# Altium project PiMX8MP_r0.3_release.PrjPcb
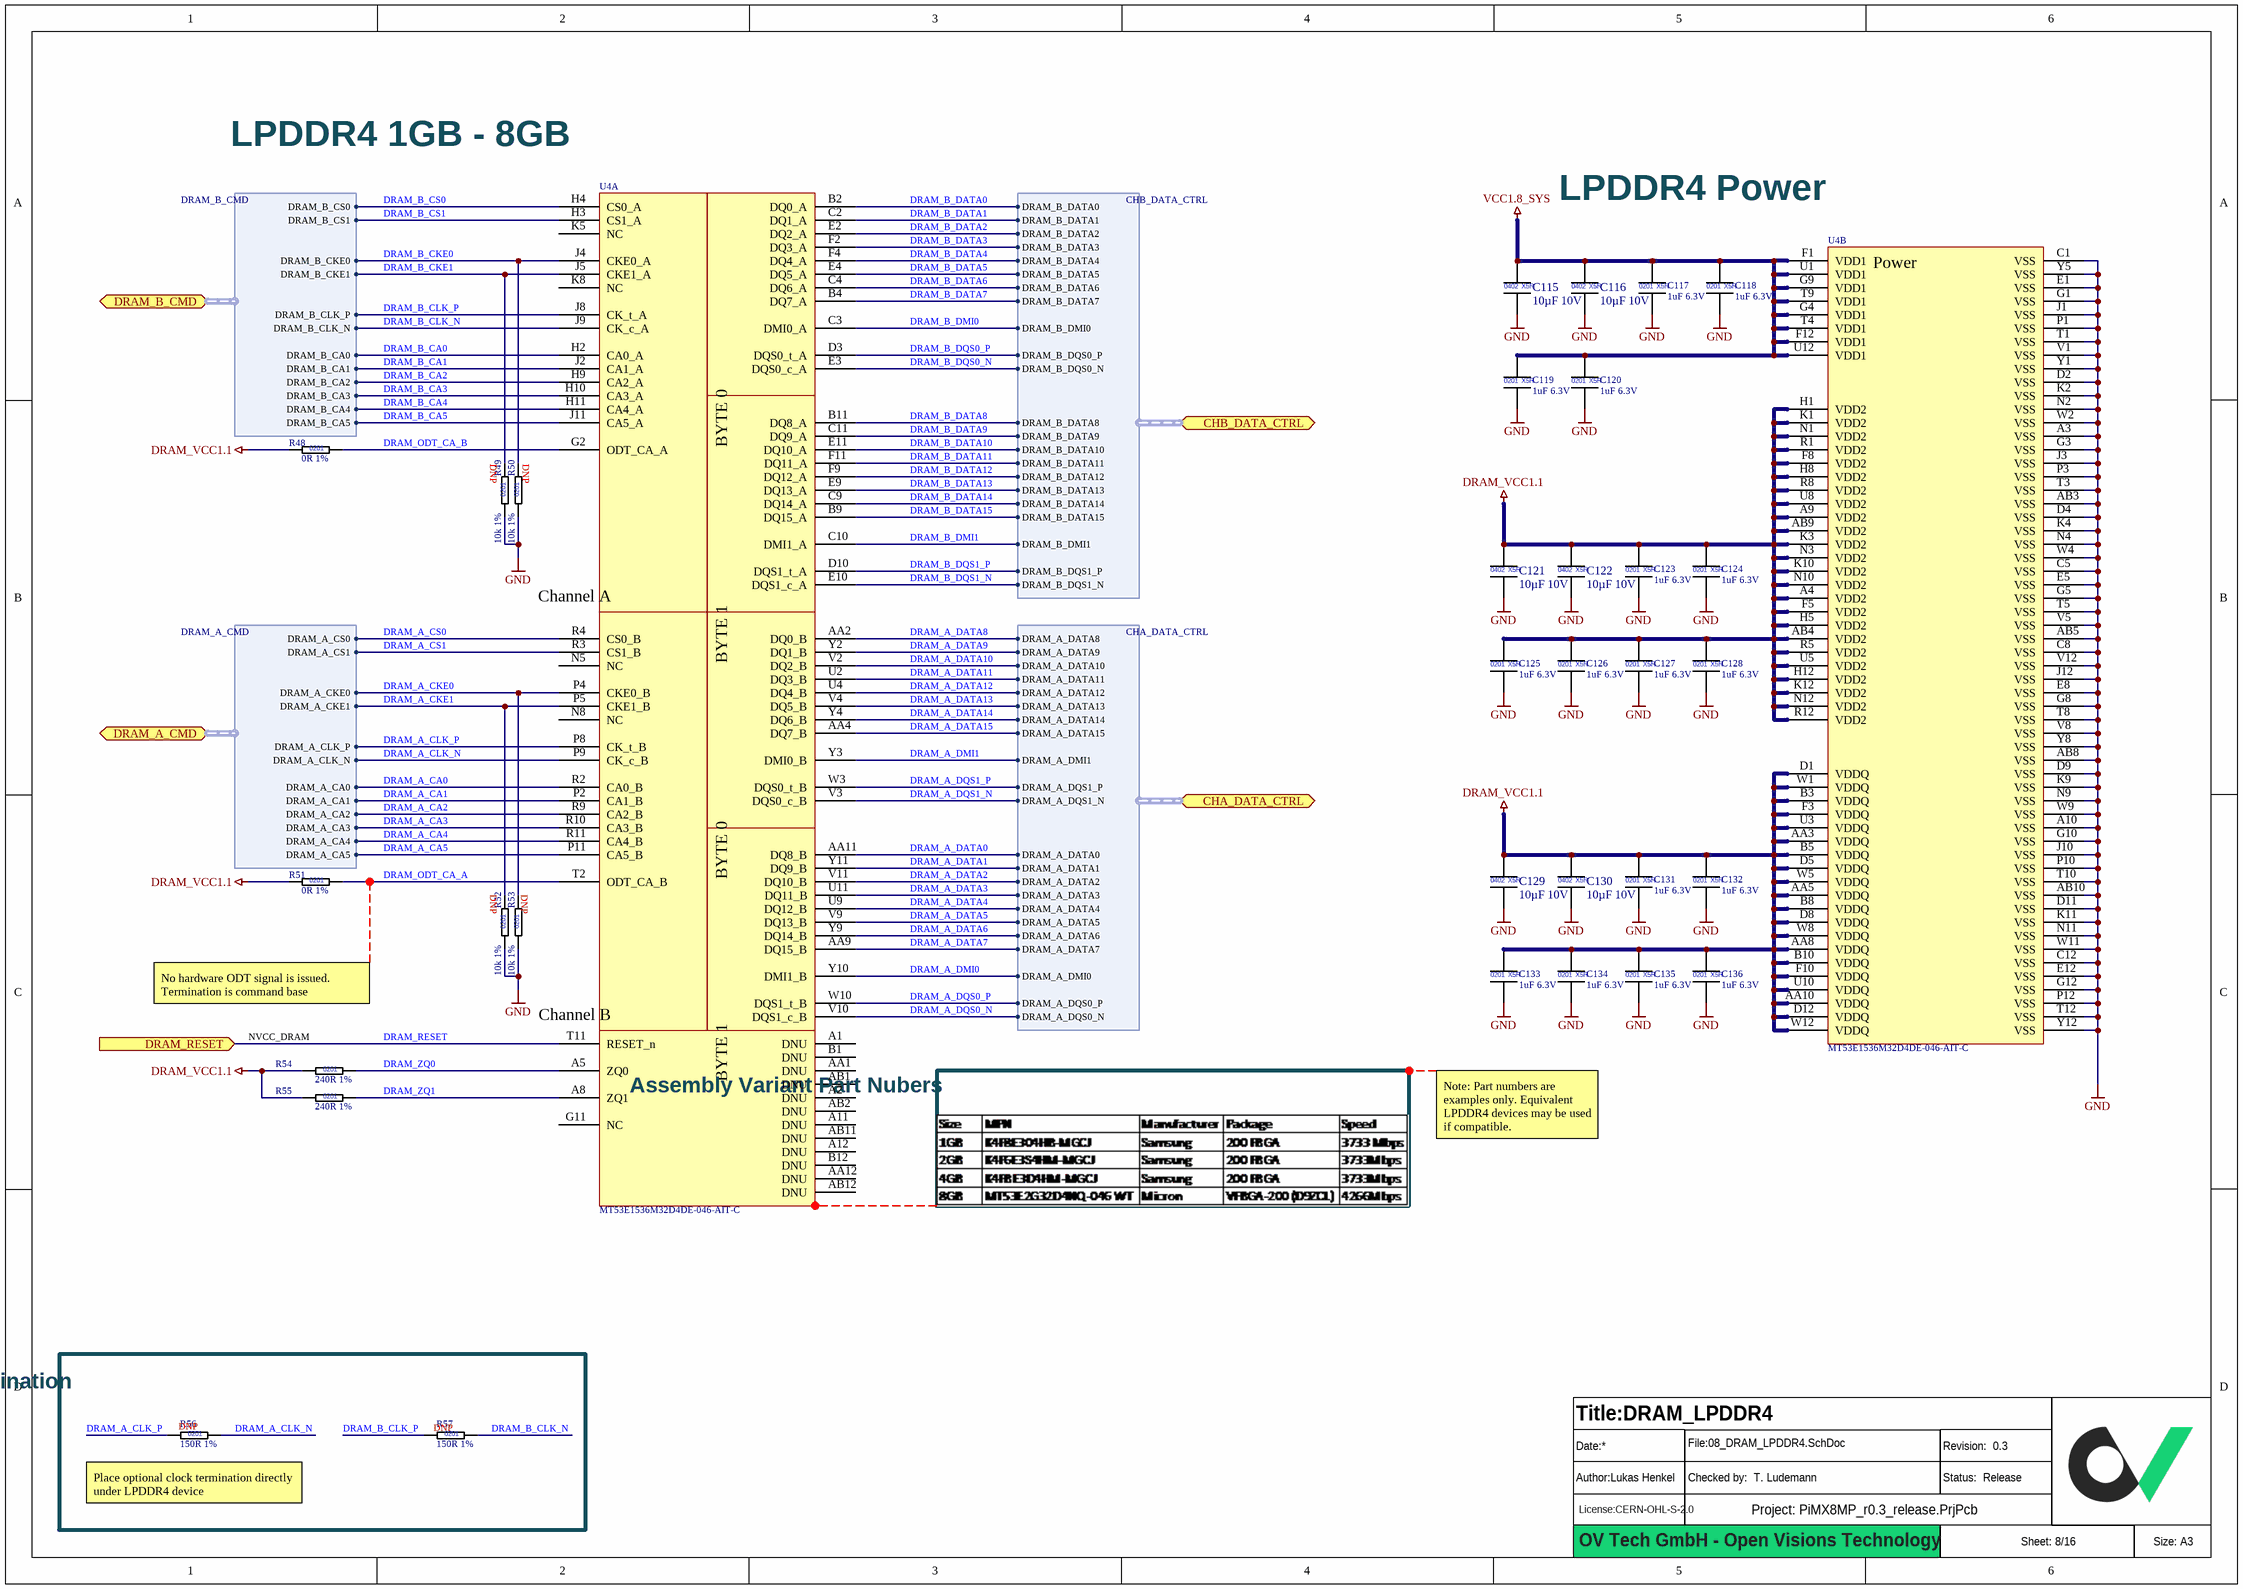
[diagram p0: 08_DRAM_LPDDR4.SchDoc]
Customer: OV Tech GmbH; DevStatus: Release; License: CERN-OHL-S-2.0; Reviewer: T. Ludemann; Revision: 0.3
2 sheets, 76 parts. Net scope: flat (ports and power ports of the same name join across sheets).
Board files: PiMX8MP_r0.3.PcbDoc, PiMX8MP_r0.3_Panel.PcbDoc
Sheets:
  08_DRAM_LPDDR4.SchDoc
  09_eMMC_Flash.SchDoc

## Sheet 08_DRAM_LPDDR4.SchDoc: DRAM_LPDDR4
size 420 x 297 mm; Author: Lukas Henkel; DocumentNumber: 8; SheetNumber: 8; SheetTotal: 16; DocSize: A3

### Parts
(Parts that share a designator on the sheet are numbered #1, #2 ... from top to bottom, then left to right.)
?#1  (no value)  (graphical)
C115  10µF 10V  [CAPC1005X06L]
C116  10µF 10V  [CAPC1005X06L]
C117  1uF 6.3V  [CAPC0603X03L]
C118  1uF 6.3V  [CAPC0603X03L]
C119  1uF 6.3V  [CAPC0603X03L]
C120  1uF 6.3V  [CAPC0603X03L]
C121  10µF 10V  [CAPC1005X06L]
C122  10µF 10V  [CAPC1005X06L]
C123  1uF 6.3V  [CAPC0603X03L]
C124  1uF 6.3V  [CAPC0603X03L]
C125  1uF 6.3V  [CAPC0603X03L]
C126  1uF 6.3V  [CAPC0603X03L]
C127  1uF 6.3V  [CAPC0603X03L]
C128  1uF 6.3V  [CAPC0603X03L]
C129  10µF 10V  [CAPC1005X06L]
C130  10µF 10V  [CAPC1005X06L]
C131  1uF 6.3V  [CAPC0603X03L]
C132  1uF 6.3V  [CAPC0603X03L]
C133  1uF 6.3V  [CAPC0603X03L]
C134  1uF 6.3V  [CAPC0603X03L]
C135  1uF 6.3V  [CAPC0603X03L]
C136  1uF 6.3V  [CAPC0603X03L]
R48  0R 1%  [RESC0603X03L]
R49  10k 1%  [RESC0603X03L]  (no BOM)
R50  10k 1%  [RESC0603X03L]  (no BOM)
R51  0R 1%  [RESC0603X03L]
R52  10k 1%  [RESC0603X03L]  (no BOM)
R53  10k 1%  [RESC0603X03L]  (no BOM)
R54  240R 1%  [RESC0603X03L]
R55  240R 1%  [RESC0603X03L]
R56  150R 1%  [RESC0603X03L]  (no BOM)
R57  150R 1%  [RESC0603X03L]  (no BOM)
U4  MT53E1536M32D4DE-046-AIT-C  [BGA200C65P12X22_1000X1450X114]  (parts A,B of 2)

### Blocks framed on the sheet
Clock Termination: R56 R57

### Ports
CHA_DATA_CTRL (bidir, harness CHA_DATA_CTRL), CHB_DATA_CTRL (bidir, harness CHB_DATA_CTRL), DRAM_A_CMD (bidir, harness DRAM_A_CMD), DRAM_B_CMD (bidir, harness DRAM_B_CMD), DRAM_RESET (in)

### Harnesses
DRAM_A_CMD: DRAM_A_CA0, DRAM_A_CA1, DRAM_A_CA2, DRAM_A_CA3, DRAM_A_CA4, DRAM_A_CA5, DRAM_A_CS0, DRAM_A_CS1, DRAM_A_CKE0, DRAM_A_CKE1, DRAM_A_CLK_P, DRAM_A_CLK_N
DRAM_B_CMD: DRAM_B_CA0, DRAM_B_CA1, DRAM_B_CA2, DRAM_B_CA3, DRAM_B_CA4, DRAM_B_CA5, DRAM_B_CS0, DRAM_B_CS1, DRAM_B_CKE0, DRAM_B_CKE1, DRAM_B_CLK_P, DRAM_B_CLK_N
CHA_DATA_CTRL: DRAM_A_DATA0, DRAM_A_DATA1, DRAM_A_DATA2, DRAM_A_DATA3, DRAM_A_DATA4, DRAM_A_DATA5, DRAM_A_DATA6, DRAM_A_DATA7, DRAM_A_DATA8, DRAM_A_DATA9, DRAM_A_DATA10, DRAM_A_DATA11, DRAM_A_DATA12, DRAM_A_DATA13, DRAM_A_DATA14, DRAM_A_DATA15, DRAM_A_DMI0, DRAM_A_DMI1, DRAM_A_DQS0_P, DRAM_A_DQS0_N, DRAM_A_DQS1_P, DRAM_A_DQS1_N
CHB_DATA_CTRL: DRAM_B_DATA0, DRAM_B_DATA1, DRAM_B_DATA2, DRAM_B_DATA3, DRAM_B_DATA4, DRAM_B_DATA5, DRAM_B_DATA6, DRAM_B_DATA7, DRAM_B_DATA8, DRAM_B_DATA9, DRAM_B_DATA10, DRAM_B_DATA11, DRAM_B_DATA12, DRAM_B_DATA13, DRAM_B_DATA14, DRAM_B_DATA15, DRAM_B_DMI0, DRAM_B_DMI1, DRAM_B_DQS0_P, DRAM_B_DQS0_N, DRAM_B_DQS1_P, DRAM_B_DQS1_N

### Nets
DRAM_VCC1.1: C121.1 C122.1 C123.1 C124.1 C125.1 C126.1 C127.1 C128.1 C129.1 C130.1 C131.1 C132.1 C133.1 C134.1 C135.1 C136.1 R48.1 R51.1 R54.1 R55.1 U4.A4(VDD2) U4.A9(VDD2) U4.AA3(VDDQ) U4.AA5(VDDQ) U4.AA8(VDDQ) U4.AA10(VDDQ) U4.AB4(VDD2) U4.AB9(VDD2) U4.B3(VDDQ) U4.B5(VDDQ) U4.B8(VDDQ) U4.B10(VDDQ) U4.D1(VDDQ) U4.D5(VDDQ) U4.D8(VDDQ) U4.D12(VDDQ) U4.F3(VDDQ) U4.F5(VDD2) U4.F8(VDD2) U4.F10(VDDQ) U4.H1(VDD2) U4.H5(VDD2) U4.H8(VDD2) U4.H12(VDD2) U4.K1(VDD2) U4.K3(VDD2) U4.K10(VDD2) U4.K12(VDD2) U4.N1(VDD2) U4.N3(VDD2) U4.N10(VDD2) U4.N12(VDD2) U4.R1(VDD2) U4.R5(VDD2) U4.R8(VDD2) U4.R12(VDD2) U4.U3(VDDQ) U4.U5(VDD2) U4.U8(VDD2) U4.U10(VDDQ) U4.W1(VDDQ) U4.W5(VDDQ) U4.W8(VDDQ) U4.W12(VDDQ)
GND: C115.2 C116.2 C117.2 C118.2 C119.2 C120.2 C121.2 C122.2 C123.2 C124.2 C125.2 C126.2 C127.2 C128.2 C129.2 C130.2 C131.2 C132.2 C133.2 C134.2 C135.2 C136.2 R49.1 R50.1 R52.1 R53.1 U4.A3(VSS) U4.A10(VSS) U4.AB3(VSS) U4.AB5(VSS) U4.AB8(VSS) U4.AB10(VSS) U4.C1(VSS) U4.C5(VSS) U4.C8(VSS) U4.C12(VSS) U4.D2(VSS) U4.D4(VSS) U4.D9(VSS) U4.D11(VSS) U4.E1(VSS) U4.E5(VSS) U4.E8(VSS) U4.E12(VSS) U4.G1(VSS) U4.G3(VSS) U4.G5(VSS) U4.G8(VSS) U4.G10(VSS) U4.G12(VSS) U4.J1(VSS) U4.J3(VSS) U4.J10(VSS) U4.J12(VSS) U4.K2(VSS) U4.K4(VSS) U4.K9(VSS) U4.K11(VSS) U4.N2(VSS) U4.N4(VSS) U4.N9(VSS) U4.N11(VSS) U4.P1(VSS) U4.P3(VSS) U4.P10(VSS) U4.P12(VSS) U4.T1(VSS) U4.T3(VSS) U4.T5(VSS) U4.T8(VSS) U4.T10(VSS) U4.T12(VSS) U4.V1(VSS) U4.V5(VSS) U4.V8(VSS) U4.V12(VSS) U4.W2(VSS) U4.W4(VSS) U4.W9(VSS) U4.W11(VSS) U4.Y1(VSS) U4.Y5(VSS) U4.Y8(VSS) U4.Y12(VSS)
VCC1.8_SYS: C115.1 C116.1 C117.1 C118.1 C119.1 C120.1 U4.F1(VDD1) U4.F12(VDD1) U4.G4(VDD1) U4.G9(VDD1) U4.T4(VDD1) U4.T9(VDD1) U4.U1(VDD1) U4.U12(VDD1)
DRAM_A_CA0: U4.R2(CA0_B) ; port DRAM_A_CMD.DRAM_A_CA0
DRAM_A_CA1: U4.P2(CA1_B) ; port DRAM_A_CMD.DRAM_A_CA1
DRAM_A_CA2: U4.R9(CA2_B) ; port DRAM_A_CMD.DRAM_A_CA2
DRAM_A_CA3: U4.R10(CA3_B) ; port DRAM_A_CMD.DRAM_A_CA3
DRAM_A_CA4: U4.R11(CA4_B) ; port DRAM_A_CMD.DRAM_A_CA4
DRAM_A_CA5: U4.P11(CA5_B) ; port DRAM_A_CMD.DRAM_A_CA5
DRAM_A_CKE0: R53.2 U4.P4(CKE0_B) ; port DRAM_A_CMD.DRAM_A_CKE0
DRAM_A_CKE1: R52.2 U4.P5(CKE1_B) ; port DRAM_A_CMD.DRAM_A_CKE1
DRAM_A_CLK_N: R56.2 U4.P9(CK_c_B) ; port DRAM_A_CMD.DRAM_A_CLK_N
DRAM_A_CLK_P: R56.1 U4.P8(CK_t_B) ; port DRAM_A_CMD.DRAM_A_CLK_P
DRAM_A_CS0: U4.R4(CS0_B) ; port DRAM_A_CMD.DRAM_A_CS0
DRAM_A_CS1: U4.R3(CS1_B) ; port DRAM_A_CMD.DRAM_A_CS1
DRAM_A_DATA0: U4.AA11(DQ8_B) ; port CHA_DATA_CTRL.DRAM_A_DATA0
DRAM_A_DATA1: U4.Y11(DQ9_B) ; port CHA_DATA_CTRL.DRAM_A_DATA1
DRAM_A_DATA2: U4.V11(DQ10_B) ; port CHA_DATA_CTRL.DRAM_A_DATA2
DRAM_A_DATA3: U4.U11(DQ11_B) ; port CHA_DATA_CTRL.DRAM_A_DATA3
DRAM_A_DATA4: U4.U9(DQ12_B) ; port CHA_DATA_CTRL.DRAM_A_DATA4
DRAM_A_DATA5: U4.V9(DQ13_B) ; port CHA_DATA_CTRL.DRAM_A_DATA5
DRAM_A_DATA6: U4.Y9(DQ14_B) ; port CHA_DATA_CTRL.DRAM_A_DATA6
DRAM_A_DATA7: U4.AA9(DQ15_B) ; port CHA_DATA_CTRL.DRAM_A_DATA7
DRAM_A_DATA8: U4.AA2(DQ0_B) ; port CHA_DATA_CTRL.DRAM_A_DATA8
DRAM_A_DATA9: U4.Y2(DQ1_B) ; port CHA_DATA_CTRL.DRAM_A_DATA9
DRAM_A_DATA10: U4.V2(DQ2_B) ; port CHA_DATA_CTRL.DRAM_A_DATA10
DRAM_A_DATA11: U4.U2(DQ3_B) ; port CHA_DATA_CTRL.DRAM_A_DATA11
DRAM_A_DATA12: U4.U4(DQ4_B) ; port CHA_DATA_CTRL.DRAM_A_DATA12
DRAM_A_DATA13: U4.V4(DQ5_B) ; port CHA_DATA_CTRL.DRAM_A_DATA13
DRAM_A_DATA14: U4.Y4(DQ6_B) ; port CHA_DATA_CTRL.DRAM_A_DATA14
DRAM_A_DATA15: U4.AA4(DQ7_B) ; port CHA_DATA_CTRL.DRAM_A_DATA15
DRAM_A_DMI0: U4.Y10(DMI1_B) ; port CHA_DATA_CTRL.DRAM_A_DMI0
DRAM_A_DMI1: U4.Y3(DMI0_B) ; port CHA_DATA_CTRL.DRAM_A_DMI1
DRAM_A_DQS0_N: U4.V10(DQS1_c_B) ; port CHA_DATA_CTRL.DRAM_A_DQS0_N
DRAM_A_DQS0_P: U4.W10(DQS1_t_B) ; port CHA_DATA_CTRL.DRAM_A_DQS0_P
DRAM_A_DQS1_N: U4.V3(DQS0_c_B) ; port CHA_DATA_CTRL.DRAM_A_DQS1_N
DRAM_A_DQS1_P: U4.W3(DQS0_t_B) ; port CHA_DATA_CTRL.DRAM_A_DQS1_P
DRAM_B_CA0: U4.H2(CA0_A) ; port DRAM_B_CMD.DRAM_B_CA0
DRAM_B_CA1: U4.J2(CA1_A) ; port DRAM_B_CMD.DRAM_B_CA1
DRAM_B_CA2: U4.H9(CA2_A) ; port DRAM_B_CMD.DRAM_B_CA2
DRAM_B_CA3: U4.H10(CA3_A) ; port DRAM_B_CMD.DRAM_B_CA3
DRAM_B_CA4: U4.H11(CA4_A) ; port DRAM_B_CMD.DRAM_B_CA4
DRAM_B_CA5: U4.J11(CA5_A) ; port DRAM_B_CMD.DRAM_B_CA5
DRAM_B_CKE0: R50.2 U4.J4(CKE0_A) ; port DRAM_B_CMD.DRAM_B_CKE0
DRAM_B_CKE1: R49.2 U4.J5(CKE1_A) ; port DRAM_B_CMD.DRAM_B_CKE1
DRAM_B_CLK_N: R57.2 U4.J9(CK_c_A) ; port DRAM_B_CMD.DRAM_B_CLK_N
DRAM_B_CLK_P: R57.1 U4.J8(CK_t_A) ; port DRAM_B_CMD.DRAM_B_CLK_P
DRAM_B_CS0: U4.H4(CS0_A) ; port DRAM_B_CMD.DRAM_B_CS0
DRAM_B_CS1: U4.H3(CS1_A) ; port DRAM_B_CMD.DRAM_B_CS1
DRAM_B_DATA0: U4.B2(DQ0_A) ; port CHB_DATA_CTRL.DRAM_B_DATA0
DRAM_B_DATA1: U4.C2(DQ1_A) ; port CHB_DATA_CTRL.DRAM_B_DATA1
DRAM_B_DATA2: U4.E2(DQ2_A) ; port CHB_DATA_CTRL.DRAM_B_DATA2
DRAM_B_DATA3: U4.F2(DQ3_A) ; port CHB_DATA_CTRL.DRAM_B_DATA3
DRAM_B_DATA4: U4.F4(DQ4_A) ; port CHB_DATA_CTRL.DRAM_B_DATA4
DRAM_B_DATA5: U4.E4(DQ5_A) ; port CHB_DATA_CTRL.DRAM_B_DATA5
DRAM_B_DATA6: U4.C4(DQ6_A) ; port CHB_DATA_CTRL.DRAM_B_DATA6
DRAM_B_DATA7: U4.B4(DQ7_A) ; port CHB_DATA_CTRL.DRAM_B_DATA7
DRAM_B_DATA8: U4.B11(DQ8_A) ; port CHB_DATA_CTRL.DRAM_B_DATA8
DRAM_B_DATA9: U4.C11(DQ9_A) ; port CHB_DATA_CTRL.DRAM_B_DATA9
DRAM_B_DATA10: U4.E11(DQ10_A) ; port CHB_DATA_CTRL.DRAM_B_DATA10
DRAM_B_DATA11: U4.F11(DQ11_A) ; port CHB_DATA_CTRL.DRAM_B_DATA11
DRAM_B_DATA12: U4.F9(DQ12_A) ; port CHB_DATA_CTRL.DRAM_B_DATA12
DRAM_B_DATA13: U4.E9(DQ13_A) ; port CHB_DATA_CTRL.DRAM_B_DATA13
DRAM_B_DATA14: U4.C9(DQ14_A) ; port CHB_DATA_CTRL.DRAM_B_DATA14
DRAM_B_DATA15: U4.B9(DQ15_A) ; port CHB_DATA_CTRL.DRAM_B_DATA15
DRAM_B_DMI0: U4.C3(DMI0_A) ; port CHB_DATA_CTRL.DRAM_B_DMI0
DRAM_B_DMI1: U4.C10(DMI1_A) ; port CHB_DATA_CTRL.DRAM_B_DMI1
DRAM_B_DQS0_N: U4.E3(DQS0_c_A) ; port CHB_DATA_CTRL.DRAM_B_DQS0_N
DRAM_B_DQS0_P: U4.D3(DQS0_t_A) ; port CHB_DATA_CTRL.DRAM_B_DQS0_P
DRAM_B_DQS1_N: U4.E10(DQS1_c_A) ; port CHB_DATA_CTRL.DRAM_B_DQS1_N
DRAM_B_DQS1_P: U4.D10(DQS1_t_A) ; port CHB_DATA_CTRL.DRAM_B_DQS1_P
DRAM_ODT_CA_A: R51.2 U4.T2(ODT_CA_B)
DRAM_ODT_CA_B: R48.2 U4.G2(ODT_CA_A)
DRAM_RESET: U4.T11(RESET_n) ; port DRAM_RESET
DRAM_ZQ0: R54.2 U4.A5(ZQ0)
DRAM_ZQ1: R55.2 U4.A8(ZQ1)

Not connected (* = marked no-connect by the designer): U4 A1(DNU) A2(DNU) A11(DNU) A12(DNU) AA1(DNU) AA12(DNU) AB1(DNU) AB2(DNU) AB11(DNU) AB12(DNU) B1(DNU) B12(DNU) G11(NC) K5(NC) K8(NC) N5(NC) N8(NC)

### Notes on the sheet
- LPDDR4 1GB - 8GB
- LPDDR4 Power
- (near R49) DNP
- (near R50) DNP
- (near R52) DNP
- (near R53) DNP
- No hardware ODT signal is issued. Termination is command base
- (near R54) NVCC_DRAM
- Assembly Variant Part Nubers
- Note: Part numbers are examples only. Equivalent LPDDR4 devices may be used if compatible.
- (near R56) DNP
- (near R57) DNP
- (near R56) Place optional clock termination directly under LPDDR4 device
- OV Tech GmbH - Open Visions Technology
- (in symbol CAP_0201_1uF_6.3V) 0201; X5R
- (in symbol CAP_0402_10µ_10V) 0402; X5R
- (in symbol LPDDR4_MT53E1536M32D4DE-046-AIT-C, part A) BYTE 0; Channel A; BYTE 1; Channel B
- (in symbol LPDDR4_MT53E1536M32D4DE-046-AIT-C, part B) Power
- (in symbol RES_0201_0R_1%) 0201
- (in symbol RES_0201_10k_1%) 0201
- (in symbol RES_0201_150R_1%) 0201
- (in symbol RES_0201_240R_1%) 0201

### Library data of the parts
?#1 = Titleblock_01_OpenSource
C115 C116 C121 C122 C129 C130 = CAP_0402_10µ_10V: Multilayer Ceramic Capacitors MLCC - SMD/SMT 0402 10VDC; Manufacturer 1: Murata Electronics; Manufacturer 1 Prt. Nr.: GRM155R61A106ME11D; Manufacturer 2 Prt. Nr.: 0402ZD106MAT4A; Manufacturer 2: KYOCERA AVX
C117-C120 C123-C128 C131-C136 = CAP_0201_1uF_6.3V: Multilayer Ceramic Capacitors MLCC - SMD/SMT 0201 6.3VDC; Manufacturer 1: Murata Electronics; Manufacturer 1 Prt. Nr.: GRM033R60J105MEA2D; Manufacturer 2 Prt. Nr.: CL03A105MQ3CSNC; Manufacturer 2: Samsung Electro-Mechanics
R48 R51 = RES_0201_0R_1%: Thick Film Resistors - SMD 0R OHM 1%; Manufacturer 1: Yageo; Manufacturer 1 Prt. Nr.: RC0201FR-070RL; Manufacturer 2 Prt. Nr.: CRCW02010000Z0ED; Manufacturer 2: Vishay / Dale
R49 R50 R52 R53 = RES_0201_10k_1%: Thick Film Resistors - SMD 10K OHM 1%; Manufacturer 1: Yageo; Manufacturer 1 Prt. Nr.: RC0201FR-0710KL; Manufacturer 2 Prt. Nr.: CRCW020110K0FNED; Manufacturer 2: Vishay / Dale
R54 R55 = RES_0201_240R_1%: Thick Film Resistors - SMD 240 OHM 1%; Manufacturer 1: Yageo; Manufacturer 1 Prt. Nr.: RC0201FR-07240RL; Manufacturer 2 Prt. Nr.: CRCW0201240RFNED; Manufacturer 2: Vishay / Dale
R56 R57 = RES_0201_150R_1%: Thick Film Resistors - SMD 150 OHM 1%; Manufacturer 1: Yageo; Manufacturer 1 Prt. Nr.: RC0201FR-07150RL; Manufacturer 2 Prt. Nr.: CRCW0201150RFNED; Manufacturer 2: Vishay / Dale
U4 = LPDDR4_MT53E1536M32D4DE-046-AIT-C: DRAM LPDDR4 48G 1.5GX32 FBGA QDP; Manufacturer 1: Micron; Manufacturer 1 Prt. Nr.: MT53E1536M32D4DE-046-AIT-C

## Sheet 09_eMMC_Flash.SchDoc: eMMC_Flash
size 420 x 297 mm; Author: Lukas Henkel; DocumentNumber: 9; SheetNumber: 9; SheetTotal: 16; DocSize: A3
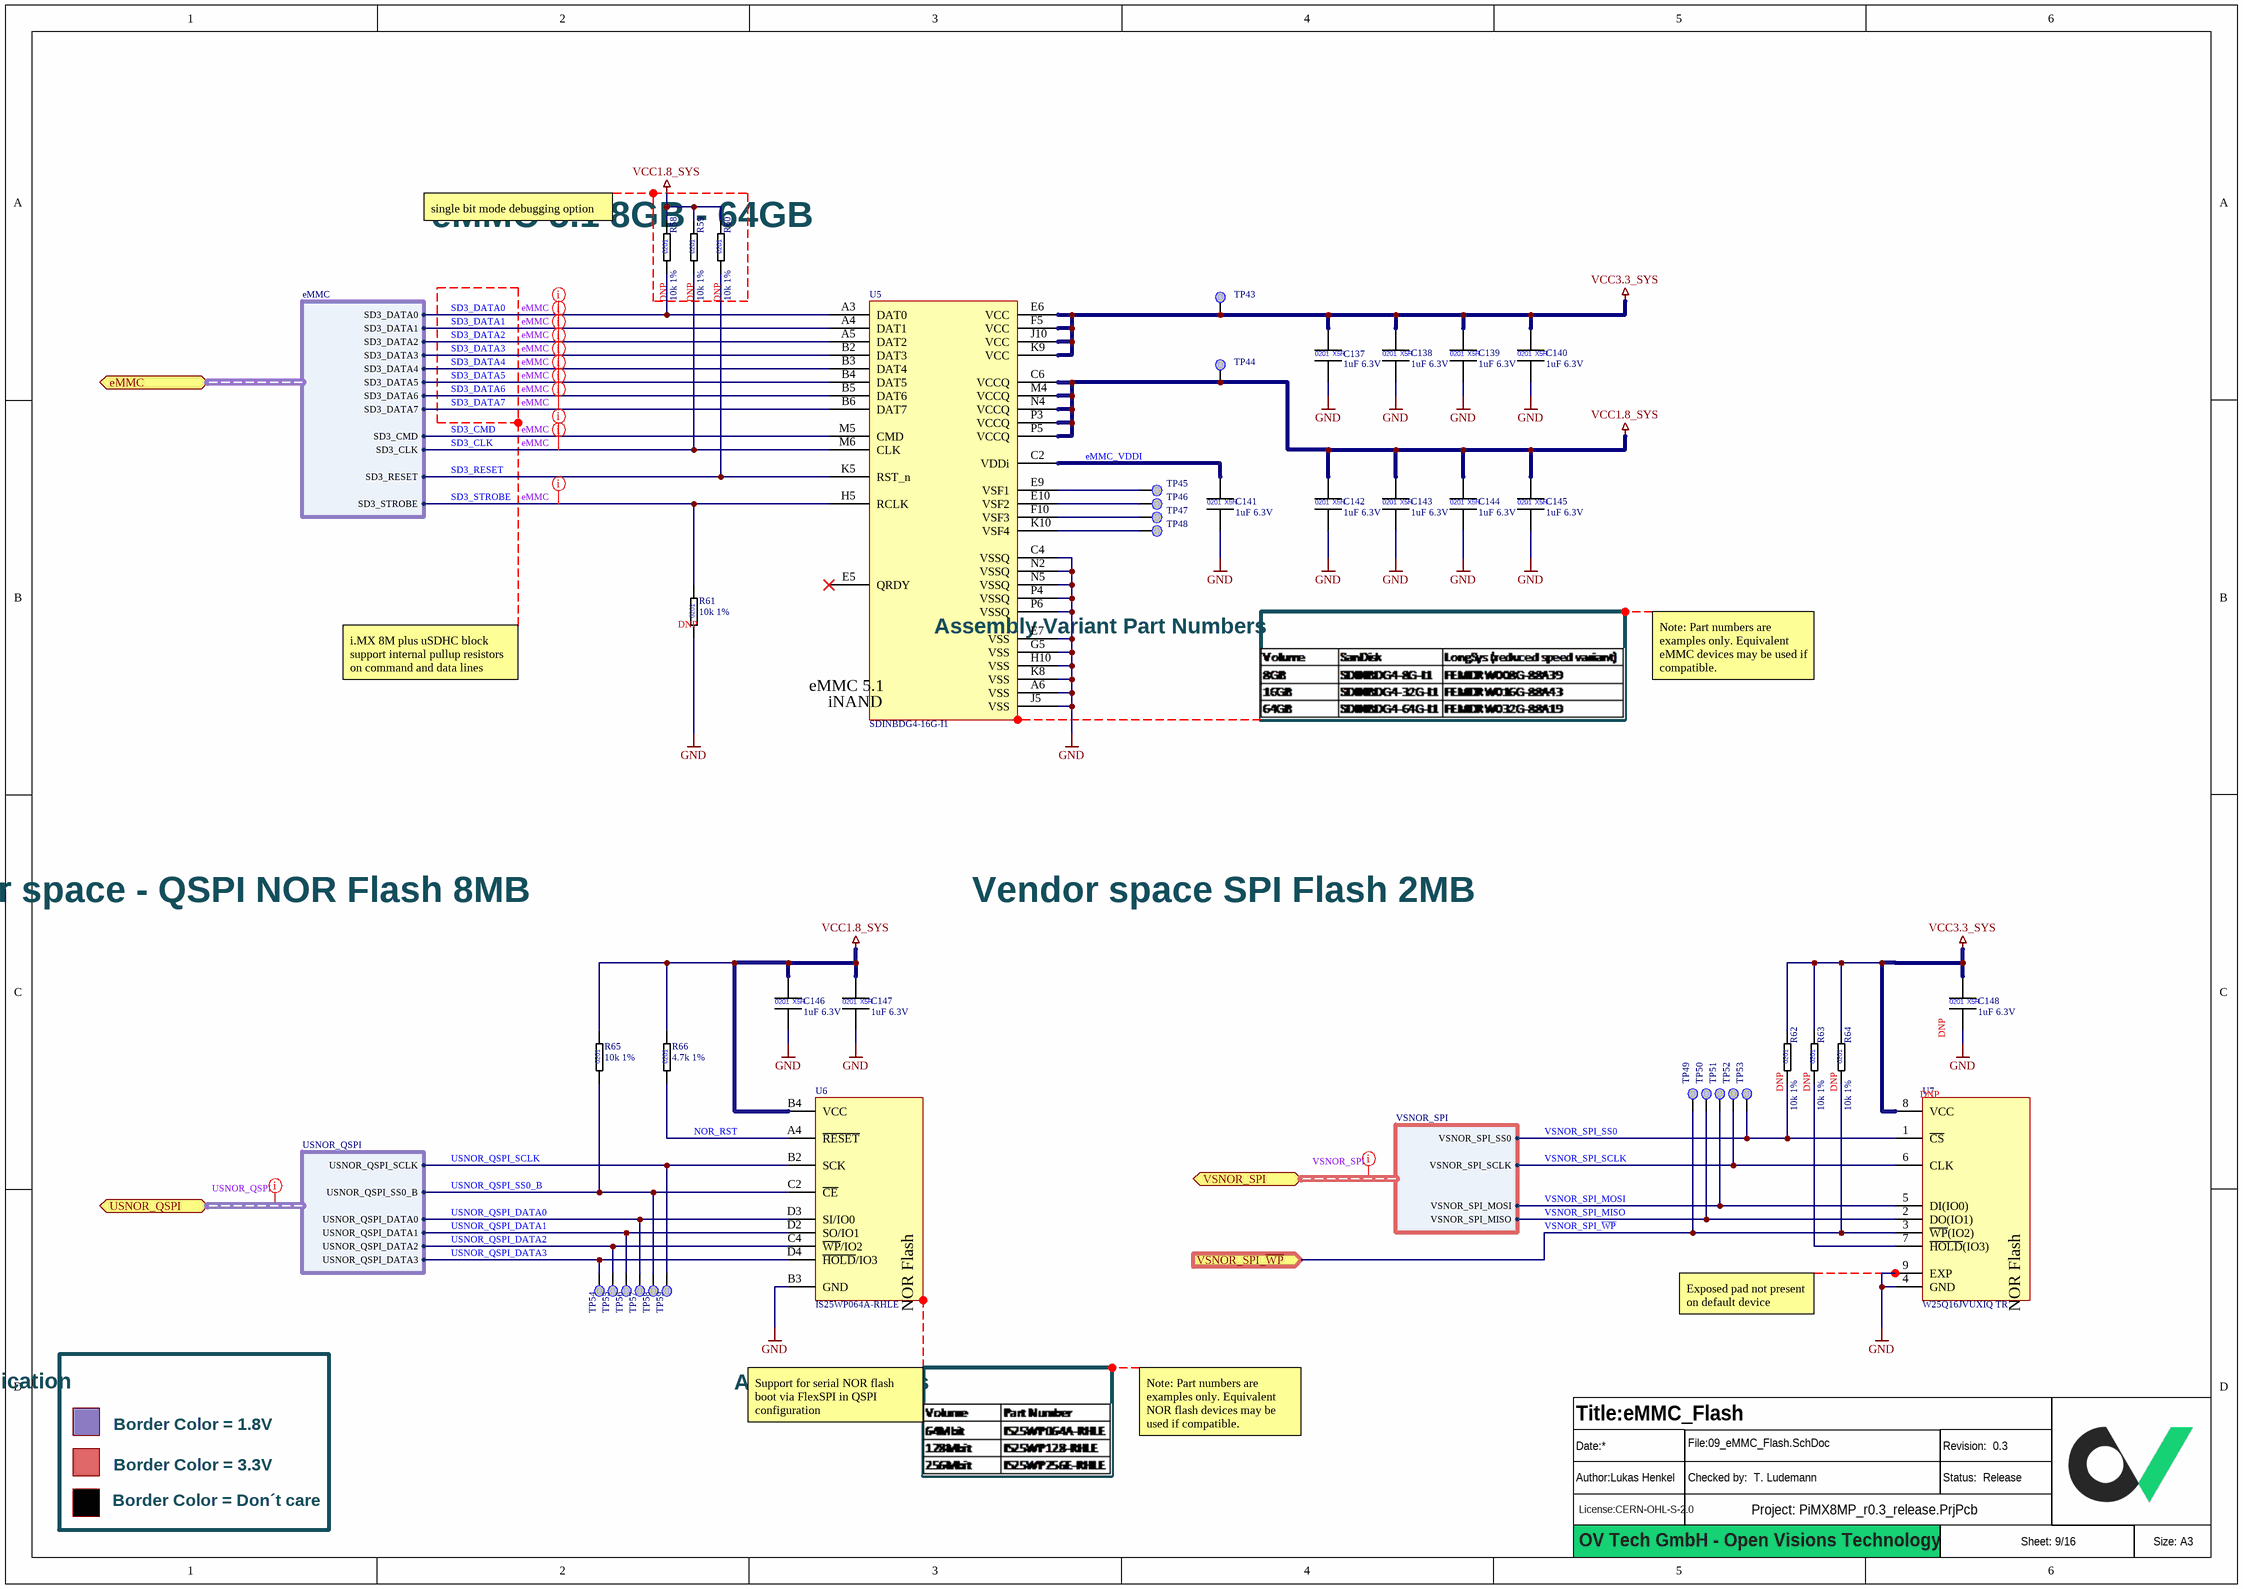
[diagram p1: 09_eMMC_Flash.SchDoc]

### Parts
(Parts that share a designator on the sheet are numbered #1, #2 ... from top to bottom, then left to right.)
?#2  (no value)  (graphical)
C137  1uF 6.3V  [CAPC0603X03L]
C138  1uF 6.3V  [CAPC0603X03L]
C139  1uF 6.3V  [CAPC0603X03L]
C140  1uF 6.3V  [CAPC0603X03L]
C141  1uF 6.3V  [CAPC0603X03L]
C142  1uF 6.3V  [CAPC0603X03L]
C143  1uF 6.3V  [CAPC0603X03L]
C144  1uF 6.3V  [CAPC0603X03L]
C145  1uF 6.3V  [CAPC0603X03L]
C146  1uF 6.3V  [CAPC0603X03L]
C147  1uF 6.3V  [CAPC0603X03L]
C148  1uF 6.3V  [CAPC0603X03L]
R58  10k 1%  [RESC0603X03L]  (no BOM)
R59  10k 1%  [RESC0603X03L]  (no BOM)
R60  10k 1%  [RESC0603X03L]
R61  10k 1%  [RESC0603X03L]  (no BOM)
R62  10k 1%  [RESC0603X03L]
R63  10k 1%  [RESC0603X03L]
R64  10k 1%  [RESC0603X03L]
R65  10k 1%  [RESC0603X03L]
R66  4.7k 1%  [RESC0603X03L]
TP43  Testpoint 0.5mm  [TP_0.50mm]  (value not drawn)  (no BOM)
TP44  Testpoint 0.5mm  [TP_0.50mm]  (value not drawn)  (no BOM)
TP45  Testpoint 0.5mm  [TP_0.50mm]  (value not drawn)  (no BOM)
TP46  Testpoint 0.5mm  [TP_0.50mm]  (value not drawn)  (no BOM)
TP47  Testpoint 0.5mm  [TP_0.50mm]  (value not drawn)  (no BOM)
TP48  Testpoint 0.5mm  [TP_0.50mm]  (value not drawn)  (no BOM)
TP49  Testpoint 0.5mm  [TP_0.50mm]  (value not drawn)  (no BOM)
TP50  Testpoint 0.5mm  [TP_0.50mm]  (value not drawn)  (no BOM)
TP51  Testpoint 0.5mm  [TP_0.50mm]  (value not drawn)  (no BOM)
TP52  Testpoint 0.5mm  [TP_0.50mm]  (value not drawn)  (no BOM)
TP53  Testpoint 0.5mm  [TP_0.50mm]  (value not drawn)  (no BOM)
TP54  Testpoint 0.5mm  [TP_0.50mm]  (value not drawn)  (no BOM)
TP55  Testpoint 0.5mm  [TP_0.50mm]  (value not drawn)  (no BOM)
TP56  Testpoint 0.5mm  [TP_0.50mm]  (value not drawn)  (no BOM)
TP57  Testpoint 0.5mm  [TP_0.50mm]  (value not drawn)  (no BOM)
TP58  Testpoint 0.5mm  [TP_0.50mm]  (value not drawn)  (no BOM)
TP59  Testpoint 0.5mm  [TP_0.50mm]  (value not drawn)  (no BOM)
U5  SDINBDG4-16G-I1  [BGA153C50P14X14_1150X1300X80]
U6  IS25WP064A-RHLE  [BGA24C100P5X5_600X800X120]
U7  W25Q16JVUXIQ TR  [QFN50P300X200X60_HS-9L]

### Ports
eMMC (bidir, harness eMMC), USNOR_QSPI (bidir, harness USNOR_QSPI), VSNOR_SPI (bidir, harness VSNOR_SPI), VSNOR_SPI_~{WP} (in)

### Harnesses
eMMC: SD3_STROBE, SD3_CLK, SD3_CMD, SD3_DATA0, SD3_DATA1, SD3_DATA2, SD3_DATA3, SD3_DATA4, SD3_DATA5, SD3_DATA6, SD3_DATA7, SD3_RESET
USNOR_QSPI: USNOR_QSPI_SCLK, USNOR_QSPI_SS0_B, USNOR_QSPI_DATA0, USNOR_QSPI_DATA1, USNOR_QSPI_DATA2, USNOR_QSPI_DATA3
VSNOR_SPI: VSNOR_SPI_SS0, VSNOR_SPI_SCLK, VSNOR_SPI_MOSI, VSNOR_SPI_MISO

### Nets
GND: C137.2 C138.2 C139.2 C140.2 C141.2 C142.2 C143.2 C144.2 C145.2 C146.2 C147.2 C148.2 R61.1 U5.A6(VSS) U5.C4(VSSQ) U5.E7(VSS) U5.G5(VSS) U5.H10(VSS) U5.J5(VSS) U5.K8(VSS) U5.N2(VSSQ) U5.N5(VSSQ) U5.P4(VSSQ) U5.P6(VSSQ) U6.B3(GND) U7.4(GND) U7.9(EXP)
VCC1.8_SYS: C142.1 C143.1 C144.1 C145.1 C146.1 C147.1 R58.2 R59.2 R60.2 R65.2 R66.2 TP44.TP U5.C6(VCCQ) U5.M4(VCCQ) U5.N4(VCCQ) U5.P3(VCCQ) U5.P5(VCCQ) U6.B4(VCC)
VCC3.3_SYS: C137.1 C138.1 C139.1 C140.1 C148.1 R62.2 R63.2 R64.2 TP43.TP U5.E6(VCC) U5.F5(VCC) U5.J10(VCC) U5.K9(VCC) U7.8(VCC)
eMMC_VDDI: C141.1 U5.C2(VDDi)
NOR_RST: R66.1 U6.A4(~{RESET})
SD3_CLK: R59.1 U5.M6(CLK) ; port eMMC.SD3_CLK
SD3_CMD: U5.M5(CMD) ; port eMMC.SD3_CMD
SD3_DATA0: R58.1 U5.A3(DAT0) ; port eMMC.SD3_DATA0
SD3_DATA1: U5.A4(DAT1) ; port eMMC.SD3_DATA1
SD3_DATA2: U5.A5(DAT2) ; port eMMC.SD3_DATA2
SD3_DATA3: U5.B2(DAT3) ; port eMMC.SD3_DATA3
SD3_DATA4: U5.B3(DAT4) ; port eMMC.SD3_DATA4
SD3_DATA5: U5.B4(DAT5) ; port eMMC.SD3_DATA5
SD3_DATA6: U5.B5(DAT6) ; port eMMC.SD3_DATA6
SD3_DATA7: U5.B6(DAT7) ; port eMMC.SD3_DATA7
SD3_RESET: R60.1 U5.K5(RST_n) ; port eMMC.SD3_RESET
SD3_STROBE: R61.2 U5.H5(RCLK) ; port eMMC.SD3_STROBE
USNOR_QSPI_DATA0: TP57.TP U6.D3(SI/IO0) ; port USNOR_QSPI.USNOR_QSPI_DATA0
USNOR_QSPI_DATA1: TP56.TP U6.D2(SO/IO1) ; port USNOR_QSPI.USNOR_QSPI_DATA1
USNOR_QSPI_DATA2: TP55.TP U6.C4(~{WP}/IO2) ; port USNOR_QSPI.USNOR_QSPI_DATA2
USNOR_QSPI_DATA3: TP54.TP U6.D4(~{HOLD}/IO3) ; port USNOR_QSPI.USNOR_QSPI_DATA3
USNOR_QSPI_SCLK: TP59.TP U6.B2(SCK) ; port USNOR_QSPI.USNOR_QSPI_SCLK
USNOR_QSPI_SS0_B: R65.1 TP58.TP U6.C2(~{CE}) ; port USNOR_QSPI.USNOR_QSPI_SS0_B
VSNOR_SPI_MISO: TP50.TP U7.2(DO(IO1)) ; port VSNOR_SPI.VSNOR_SPI_MISO
VSNOR_SPI_MOSI: TP51.TP U7.5(DI(IO0)) ; port VSNOR_SPI.VSNOR_SPI_MOSI
VSNOR_SPI_SCLK: TP52.TP U7.6(CLK) ; port VSNOR_SPI.VSNOR_SPI_SCLK
VSNOR_SPI_SS0: R62.1 TP53.TP U7.1(~{CS}) ; port VSNOR_SPI.VSNOR_SPI_SS0
VSNOR_SPI_~{WP}: R64.1 TP49.TP U7.3(~{WP}(IO2)) ; port VSNOR_SPI_~{WP}
NetR63_1: R63.1 U7.7(~{HOLD}(IO3))
NetTP45_TP: TP45.TP U5.E9(VSF1)
NetTP46_TP: TP46.TP U5.E10(VSF2)
NetTP47_TP: TP47.TP U5.F10(VSF3)
NetTP48_TP: TP48.TP U5.K10(VSF4)

Not connected (* = marked no-connect by the designer): U5 E5(QRDY)*

### Layout directives
net class eMMC: SD3_CLK, SD3_CMD, SD3_DATA0, SD3_DATA1, SD3_DATA2, SD3_DATA3, SD3_DATA4, SD3_DATA5, SD3_DATA6, SD3_DATA7, SD3_STROBE
net class USNOR_QSPI: (no net found under the mark)
net class VSNOR_SPI: (no net found under the mark)

### Notes on the sheet
- eMMC 5.1 8GB - 64GB
- single bit mode debugging option
- (near R58) DNP
- (near R59) DNP
- (near R60) DNP
- (near R61) DNP
- Assembly Variant Part Numbers
- i.MX 8M plus uSDHC block support internal pullup resistors on command and data lines
- Note: Part numbers are examples only. Equivalent eMMC devices may be used if compatible.
- User space - QSPI NOR Flash 8MB
- Vendor space SPI Flash 2MB
- (near R62) DNP
- (near R63) DNP
- (near R64) DNP
- (near C148) DNP
- (near U7) DNP
- Exposed pad not present on default device
- Signal Level Indication
- Assembly Variants
- Border Color = 1.8V
- Border Color = 3.3V
- Support for serial NOR flash boot via FlexSPI in QSPI configuration
- Note: Part numbers are examples only. Equivalent NOR flash devices may be used if compatible.
- Border Color = Don´t care
- OV Tech GmbH - Open Visions Technology
- (in symbol CAP_0201_1uF_6.3V) 0201; X5R
- (in symbol eMMC_SDINBDG4-16G-I1) eMMC 5.1; iNAND
- (in symbol NOR_Flash_IS25WP064A-RHLE) NOR Flash
- (in symbol NOR_Flash_W25Q16) NOR Flash
- (in symbol RES_0201_4.7k_1%) 0201
- (in symbol RES_0201_10k_1%) 0201

### Library data of the parts
?#2 = Titleblock_01_OpenSource
C137-C148 = CAP_0201_1uF_6.3V: as C117 on sheet 08_DRAM_LPDDR4; Manufacturer 2: Samsung Electro-Mechanics
R58-R65 = RES_0201_10k_1%: as R49 on sheet 08_DRAM_LPDDR4; Manufacturer 2: Vishay / Dale
R66 = RES_0201_4.7k_1%: Thick Film Resistors - SMD 4.7K OHM 1%; Manufacturer 1: Yageo; Manufacturer 1 Prt. Nr.: RC0201JR-074K7P; Manufacturer 2 Prt. Nr.: CRCW02014K70FNED; Manufacturer 2: Vishay / Dale
U5 = eMMC_SDINBDG4-16G-I1: iNAND eMMC 16GB; Manufacturer 1: SanDisk; Manufacturer 1 Prt. Nr.: SDINBDG4-16G-I1
U6 = NOR_Flash_IS25WP064A-RHLE: NOR Flash 64Mbit; Manufacturer 1: ISSI; Manufacturer 1 Prt. Nr.: IS25WP064A-RHLE
U7 = NOR_Flash_W25Q16: NOR Flash spiFlash, 3V, 16M-bit, 4Kb Uniform Sector, DTR; Manufacturer 1: Winbond; Manufacturer 1 Prt. Nr.: W25Q16JVUXIQ TR; Temperature Range: -40°C - 85°C

## Nets that join several sheets
GND: 08_DRAM_LPDDR4 (84 pins), 09_eMMC_Flash (27 pins)
VCC1.8_SYS: 08_DRAM_LPDDR4 (14 pins), 09_eMMC_Flash (18 pins)

## Assembly variants
Default_Config_0: not fitted C148 C182 C183 C184 C185 C186 C187 C188 C189 C190 C191 C198 J2 J6 L10 Q1 R1 R2 R18 R19 R20 R21 R22 R23 R44 R45 R49 R50 R52 R53 R56 R57 R58 R59 R60 R61 R62 R63 R64 R70 R71 R72 R74 R80 R84 R85 R86 R92 R96 R100 R101 R102 R104 R107 R108 R109 R110 R111 R115 R122 R125 R127 R128 R129 R130 R131 R132 R133 R134 R135 R136 R137 R138 R139 R140 R141 R159 R185 U7 U13 U14 U15
TPU: not fitted C148 C186 J2 R1 R2 R18 R19 R20 R21 R22 R23 R44 R45 R49 R50 R52 R53 R56 R57 R58 R59 R60 R61 R62 R63 R64 R70 R71 R72 R74 R80 R84 R85 R86 R92 R96 R100 R101 R102 R104 R107 R108 R109 R110 R111 R115 R122 R125 R136 R137 R138 R139 R140 R141 R159 U7